# EAGLE schematic Maduino Zero 4G LTE A7670X v1.1 (EAGLE 6.1)
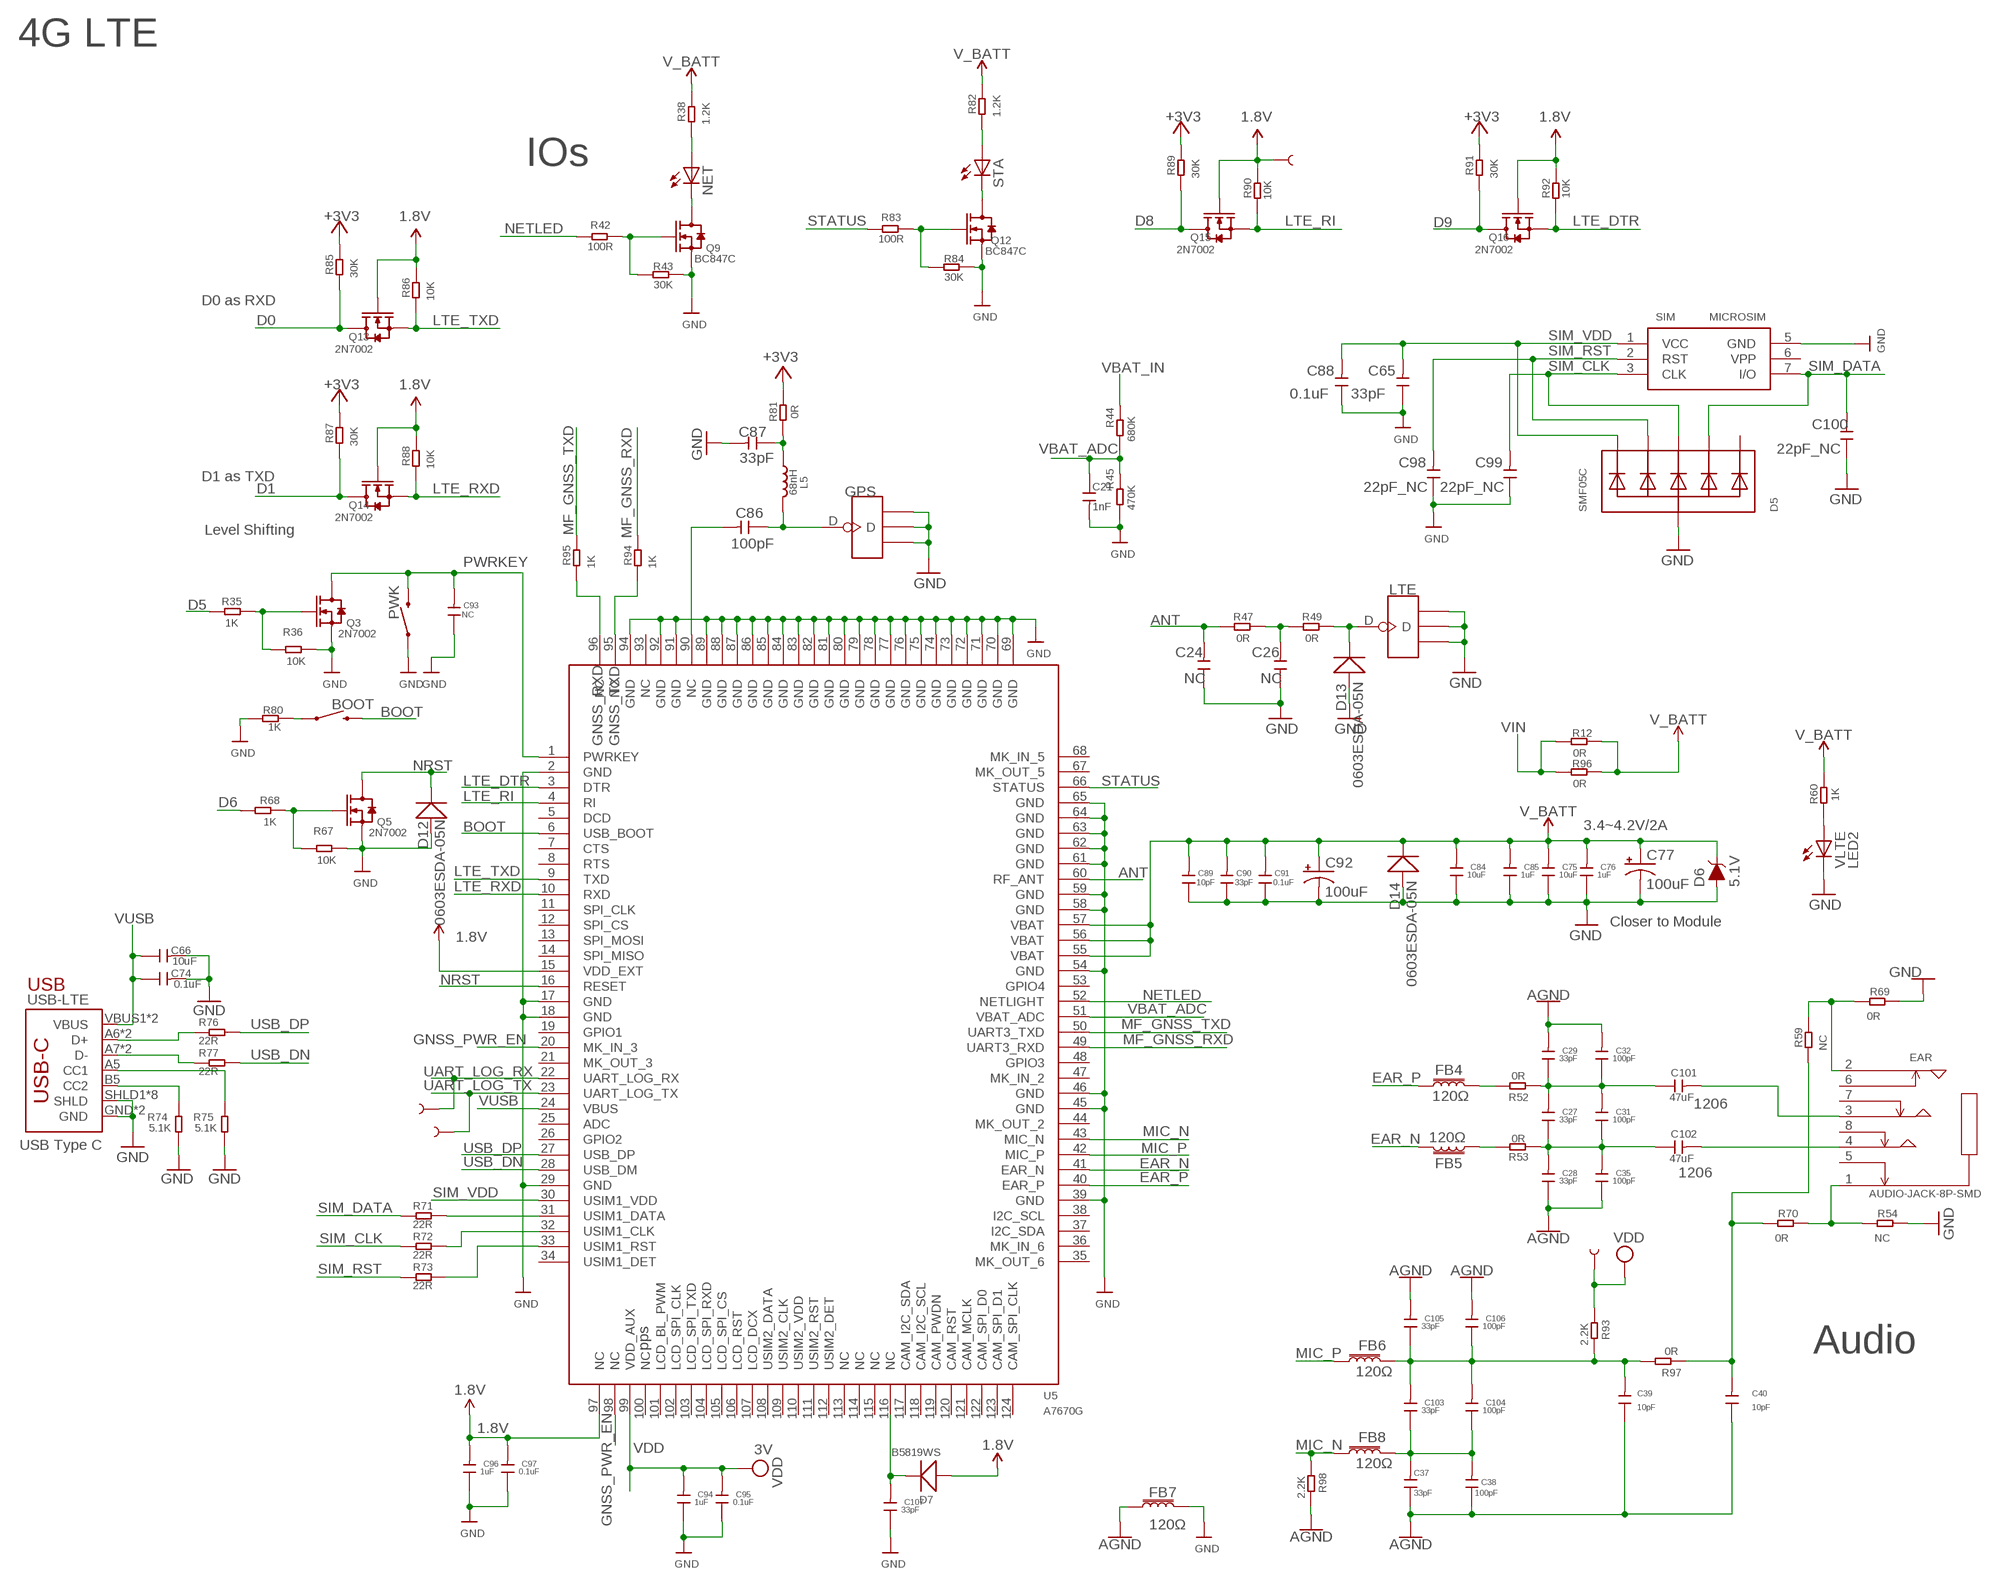
[diagram p0: schematic, sheet 1, part 1 of 2]
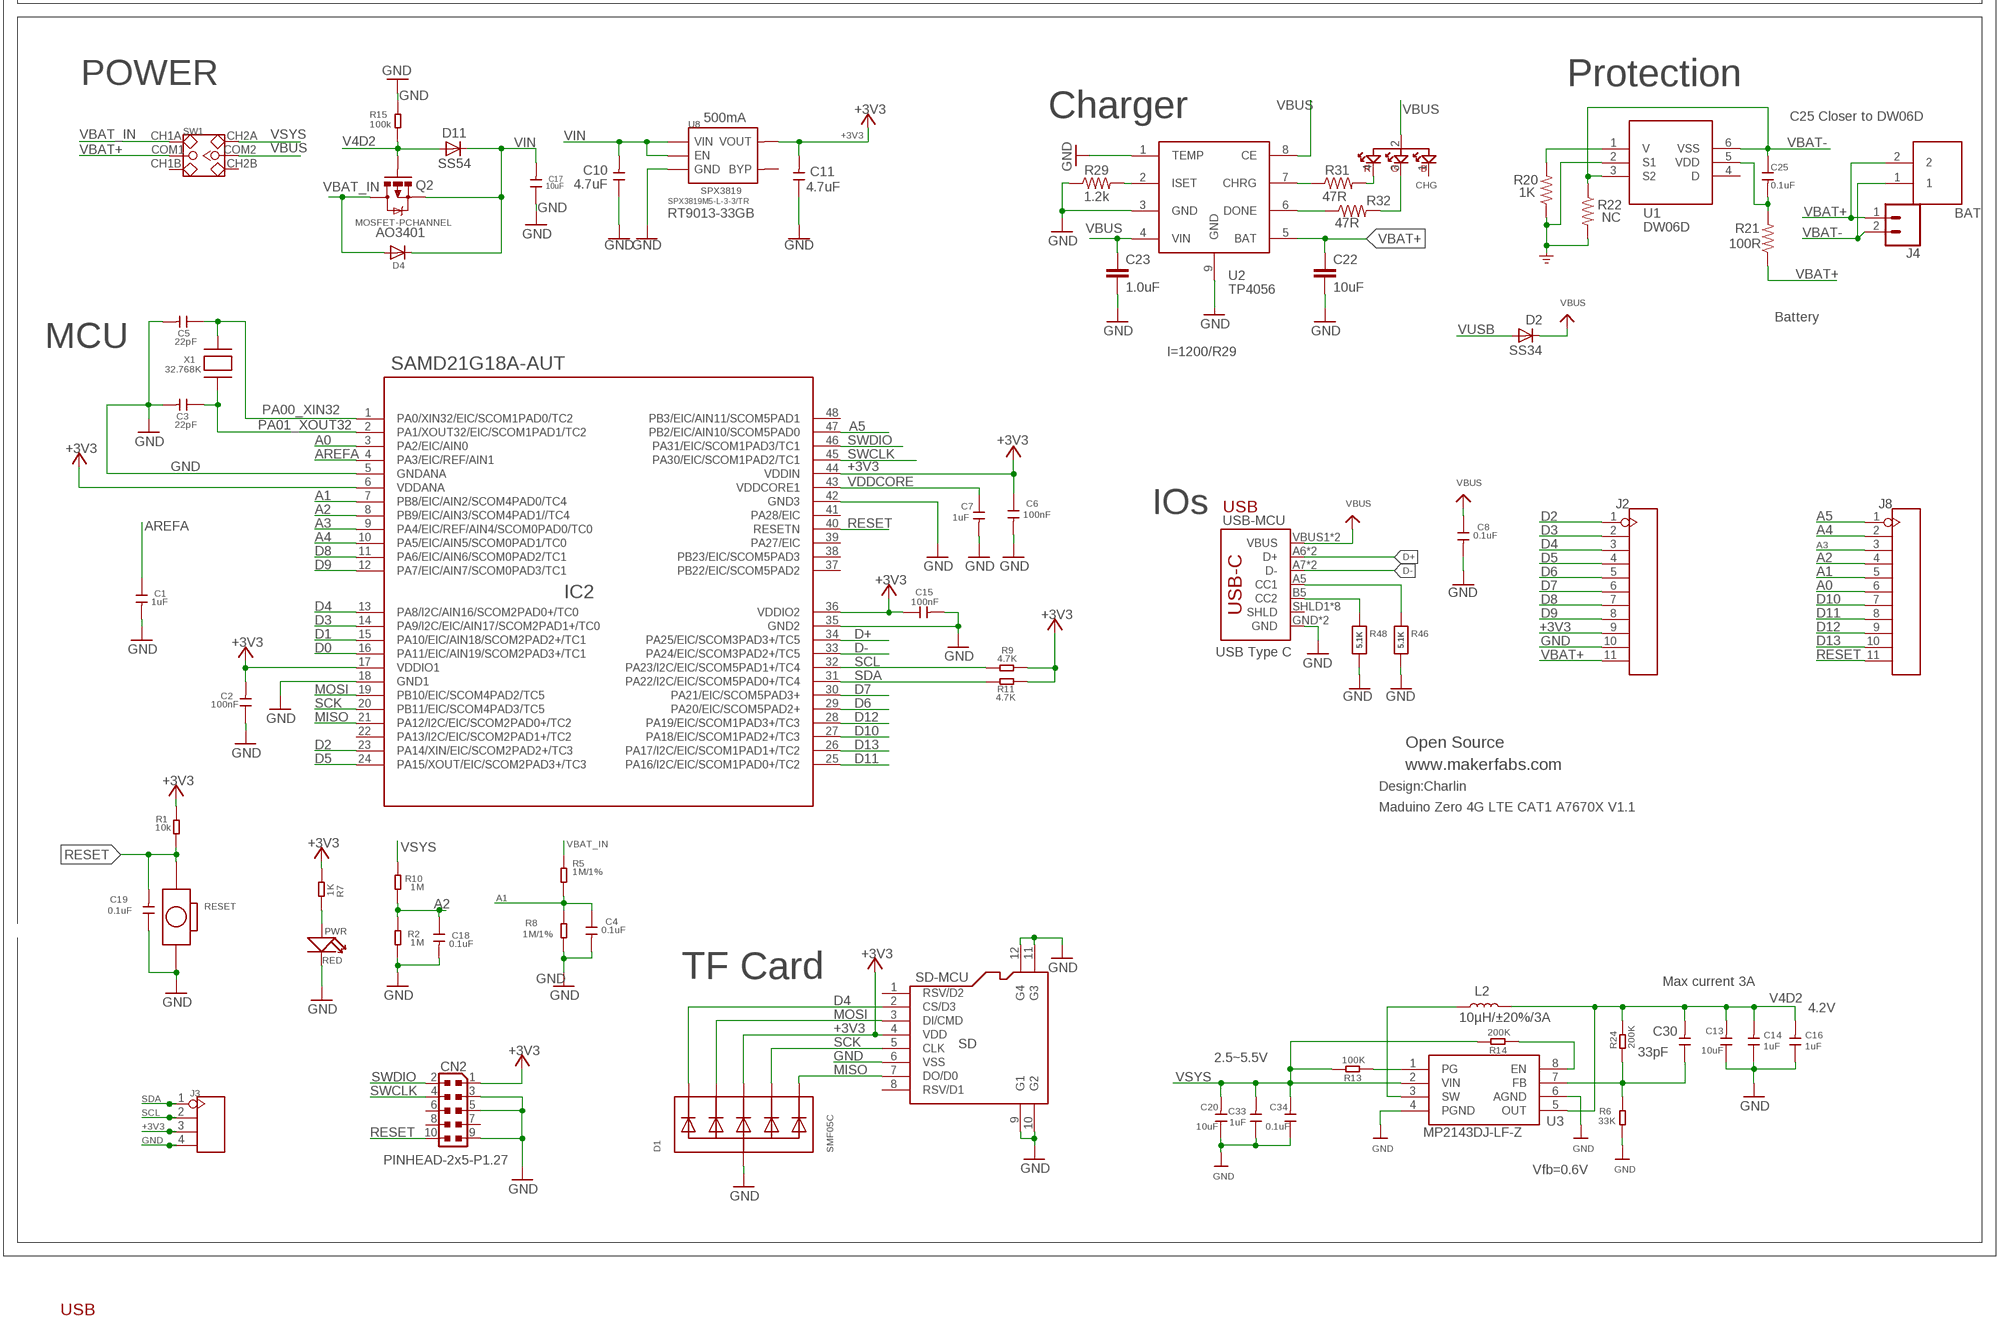
[diagram p1: schematic, sheet 1, part 2 of 2]

## Parts
BAT  PH2.0-2P-90-DIP  [PH2.0-2P-90-DIP]
BOOT  MOMENTARY-SWITCH-SPST-SMD-6.0X3.5MM  [TACTILE_SWITCH_SMD_6.0X3.5MM]
C1  1uF  C-0603  [0603]
C2  100nF  C-0603  [0603]
C3  22pF  C-0603  [0603]
C4  0.1uF  C-0603  [0603]
C5  22pF  C-0603  [0603]
C6  100nF  C-0603  [0603]
C7  1uF  C-0603  [0603]
C8  0.1uF  C-0603  [0603]
C10  4.7uF  C-0603  [0603]
C11  4.7uF  C-0603  [0603]
C13  10uF  C-0603  [0603]
C14  1uF  C-0603  [0603]
C15  100nF  C-0603  [0603]
C16  1uF  C-0603  [0603]
C17  10uF  C-0603  [0603]
C18  0.1uF  C-0603  [0603]
C19  0.1uF  C-0603  [0603]
C20  10uF  C-0603  [0603]
C21  1nF  C-0603  [0603]
C22  10uF  1.0UF-0603-16V-10%  [0603]
C23  1.0uF  1.0UF-0603-16V-10%  [0603]
C24  NC  C-0603  [0603]
C25  0.1uF  C-0603  [0603]
C26  NC  C-0603  [0603]
C27  33pF  C-0603  [0603]
C28  33pF  C-0603  [0603]
C29  33pF  C-0603  [0603]
C30  33pF  C-0603  [0603]
C31  100pF  C-0603  [0603]
C32  100pF  C-0603  [0603]
C33  1uF  C-0603  [0603]
C34  0.1uF  C-0603  [0603]
C35  100pF  C-0603  [0603]
C37  33pF  C-0603  [0603]
C38  100pF  C-0603  [0603]
C39  10pF  C-0603  [0603]
C40  10pF  C-0603  [0603]
C65  33pF  C-0603  [0603]
C66  10uF  C-0603  [0603]
C74  0.1uF  C-0603  [0603]
C75  10uF  C-0603  [0603]
C76  1uF  C-0603  [0603]
C77  100uF  68UF-POLAR-EIA3528-10V-10%(TANT)  [EIA3528]
C84  10uF  C-0603  [0603]
C85  1uF  C-0603  [0603]
C86  100pF  C-0603  [0603]
C87  33pF  C-0603  [0603]
C88  0.1uF  C-0603  [0603]
C89  10pF  C-0603  [0603]
C90  33pF  C-0603  [0603]
C91  0.1uF  C-0603  [0603]
C92  100uF  68UF-POLAR-EIA3528-10V-10%(TANT)  [EIA3528]
C93  NC  C-0603  [0603]
C94  1uF  C-0603  [0603]
C95  0.1uF  C-0603  [0603]
C96  1uF  C-0603  [0603]
C97  0.1uF  C-0603  [0603]
C98  22pF_NC  C-0603  [0603]
C99  22pF_NC  C-0603  [0603]
C100  22pF_NC  C-0603  [0603]
C101  47uF  DISCRETE_C-1206  [DISCRETE_C1206]
C102  47uF  DISCRETE_C-1206  [DISCRETE_C1206]
C103  33pF  C-0603  [0603]
C104  100pF  C-0603  [0603]
C105  33pF  C-0603  [0603]
C106  100pF  C-0603  [0603]
C107  33pF  C-0603  [0603]
CHG  E6C0606RGBC3UDA  [SMD4-160L160W]
CN2  PINHEAD-2x5-P1.27  0171_PH127-205DF055G00AROUND-PADS  [PINHEAD_2X05_127]
D1  SMF05C  TVSARRAY_5LANE  [SOT363]
D2  SS34  DIODE-DO-214AC  [DO-214AC]
D4  DIODESOD-323F  [SOD-323F]
D5  SMF05C  TVSARRAY_5LANE  [SOT363]
D6  5.1V  DIODE-ZENER-MMSZ5232BS  [SOD-323]
D7  B5819WS  D'0805'  [SOD323]
D11  SS54  DIODE-DO-214AC  [DO-214AC]
D12  0603ESDA-05N  DISCRETE_D0603  [DISCRETE_SOD523]
D13  0603ESDA-05N  DISCRETE_D0603  [DISCRETE_SOD523]
D14  0603ESDA-05N  DISCRETE_D0603  [DISCRETE_SOD523]
EAR  AUDIO-JACK-8P-SMD  AUDIO-JACK-8P-SMD'PJ-393'  [AUDIO8P-SMD-3.5-14.5X6.1X4.0MM]
FB4  120Ω  FERRITE_BEAD-0603  [0603]
FB5  120Ω  FERRITE_BEAD-0603  [0603]
FB6  120Ω  FERRITE_BEAD-0603  [0603]
FB7  120Ω  FERRITE_BEAD-0603  [0603]
FB8  120Ω  FERRITE_BEAD-0603  [0603]
GPS  ANTENNA-U-FL  [4P-U-FL]
IC2  SAMD21G18A-AUT  ATSAMD21G18A-AUT  [TQFP48-7X7]
J2  HEADER-11P-2.54  [11P-2.54]
J3  HEADER-4P-60/35MILROUND  [4P-65/35ROUND]
J4  CONN_02LOCK  [1X02_LOCK]
J8  HEADER-11P-2.54  [11P-2.54]
L2  10µH/±20%/3A  INDUCTOR-SRN6045-33UH  [SRN6045]
L5  68nH  L'0603'  [L0603]
LTE  ANTENNA-U-FL  [4P-U-FL]
NET  NET  LEDCHIP-LED0805  [CHIP-LED0805]
PWK  MOMENTARY-SWITCH-SPST-SMD-6.0X3.5MM  [TACTILE_SWITCH_SMD_6.0X3.5MM]
PWR  RED  LED'0603'  [LED-0603]
Q2  MOSFET-PCHANNEL  [SOT23-3]
Q3  2N7002  MOSFET-N'SOT23'  [SOT23]
Q5  2N7002  MOSFET-N'SOT23'  [SOT23]
Q9  BC847C  MOSFET-N'SOT23'  [SOT23]
Q12  BC847C  MOSFET-N'SOT23'  [SOT23]
Q13  2N7002  MOSFET-N'SOT23'  [SOT23]
Q14  2N7002  MOSFET-N'SOT23'  [SOT23]
Q15  2N7002  MOSFET-N'SOT23'  [SOT23]
Q16  2N7002  MOSFET-N'SOT23'  [SOT23]
R1  10k  R-0603  [R0603]
R2  1M  R-0603  [R0603]
R5  1M/1%  R-0603  [R0603]
R6  33K  R-0603  [R0603]
R7  1K  R-0603  [R0603]
R8  1M/1%  R-0603  [R0603]
R9  4.7K  R-0603  [R0603]
R10  1M  R-0603  [R0603]
R11  4.7K  R-0603  [R0603]
R12  0R  R-0603  [R0603]
R13  100K  R-0603  [R0603]
R14  200K  R-0603  [R0603]
R15  100k  R-0603  [R0603]
R20  1K  10KOHM-0603-1/10W-1%  [0603]
R21  100R  10KOHM-0603-1/10W-1%  [0603]
R22  NC  10KOHM-0603-1/10W-1%  [0603]
R24  200K  R-0603  [R0603]
R29  1.2k  2.49KOHM-0603-1/10W-1%  [0603]
R31  47R  330OHM-0603-1/10W-1%  [0603]
R32  47R  330OHM-0603-1/10W-1%  [0603]
R35  1K  R-0603  [R0603]
R36  10K  R-0603  [R0603]
R38  1.2K  R-0603  [R0603]
R42  100R  R-0603  [R0603]
R43  30K  R-0603  [R0603]
R44  680K  R-0603  [R0603]
R45  470K  R-0603  [R0603]
R46  5.1K  RESISTOR_0603_NOOUT  [0603-NO]
R47  0R  R-0603  [R0603]
R48  5.1K  RESISTOR_0603_NOOUT  [0603-NO]
R49  0R  R-0603  [R0603]
R52  0R  R-0603  [R0603]
R53  0R  R-0603  [R0603]
R54  NC  R-0603  [R0603]
R59  NC  R-0603  [R0603]
R60  1K  R-0603  [R0603]
R67  10K  R-0603  [R0603]
R68  1K  R-0603  [R0603]
R69  0R  R-0603  [R0603]
R70  0R  R-0603  [R0603]
R71  22R  R-0603  [R0603]
R72  22R  R-0603  [R0603]
R73  22R  R-0603  [R0603]
R74  5.1K  R-0603  [R0603]
R75  5.1K  R-0603  [R0603]
R76  22R  R-0603  [R0603]
R77  22R  R-0603  [R0603]
R80  1K  R-0603  [R0603]
R81  0R  R-0603  [R0603]
R82  1.2K  R-0603  [R0603]
R83  100R  R-0603  [R0603]
R84  30K  R-0603  [R0603]
R85  30K  R-0603  [R0603]
R86  10K  R-0603  [R0603]
R87  30K  R-0603  [R0603]
R88  10K  R-0603  [R0603]
R89  30K  R-0603  [R0603]
R90  10K  R-0603  [R0603]
R91  30K  R-0603  [R0603]
R92  10K  R-0603  [R0603]
R93  2.2K  R-0603  [R0603]
R94  1K  R-0603  [R0603]
R95  1K  R-0603  [R0603]
R96  0R  R-0603  [R0603]
R97  0R  R-0603  [R0603]
R98  2.2K  R-0603  [R0603]
RESET  BOTTON-2P-90D  [2P-7.62X3.56-90D]
SD-MCU  SD  HOLDER-MICROSD-8P  [8P-SMD]
SIM  MICROSIM  [MICROSIM]
STA  NET  LEDCHIP-LED0805  [CHIP-LED0805]
SW1  SWITCH-2CH-6P  [6P-2CH-2.54-7.6X3.0]
TP1  TEST-POINT3  [PAD.03X.03]
TP2  TEST-POINT3  [PAD.03X.03]
TP3  TEST-POINT3  [PAD.03X.03]
TP6  TEST-POINT3  [PAD.03X.03]
U1  DW06D  [SOT-23-6]
U2  TP4056  [SOP8-1.27P]
U3  MP2143DJ-LF-Z  [TSOT23-8]
U5  A7670G  [A7670G]
U8  SPX3819  [SOT23-5]
USB-LTE  USB_C5  [USB-C-16P-5]
USB-MCU  USB_C5  [USB-C-16P-5]
VLTE  LED2  LEDCHIP-LED0805  [CHIP-LED0805]
X1  32.768K  XTAL-3.2X1.5  [XTAL3215]

## Nets
1.8V: C96.2 C97.2 D7.+ Q13.1(G) Q14.1(G) Q15.1(G) Q16.1(G) R86.2 R88.2 R90.2 R92.2 TP6.P$1 U5.15(VDD_EXT) U5.97(NC)
+3V3: C2.2 C6.1 C11.2 C15.1 CN2.1 D1.4(C3) IC2.6(VDDANA) IC2.17(VDDIO1) IC2.36(VDDIO2) IC2.44(VDDIN) J2.9 J3.3 R1.2 R7.1 R9.2 R11.2 R81.2 R85.2 R87.2 R89.2 R91.2 SD-MCU.4(VDD) U8.5(VOUT)
A0: IC2.3(PA2/EIC/AIN0) J8.6
A1: C4.1 IC2.7(PB8/EIC/AIN2/SCOM4PAD0/TC4) J8.5 R5.1 R8.2
A2: C18.1 IC2.8(PB9/EIC/AIN3/SCOM4PAD1//TC4) J8.4 R2.2 R10.1
A3: IC2.9(PA4/EIC/REF/AIN4/SCOM0PAD0/TC0) J8.3
A4: IC2.10(PA5/EIC/AIN5/SCOM0PAD1/TC0) J8.2
A5: IC2.47(PB2/EIC/AIN10/SCOM5PAD0) J8.1
AGND: C28.1 C29.2 C32.2 C35.1 C37.1 C38.1 C39.1 C40.1 C105.2 C106.2 FB7.1 R98.2
ANT: C24.2 R47.1 U5.60(RF_ANT)
AREFA: C1.1 IC2.4(PA3/EIC/REF/AIN1)
BOOT: BOOT.2 U5.6(USB_BOOT)
D0: IC2.16(PA11/EIC/AIN19/SCOM2PAD3+/TC1) Q13.3(D) R85.1
D1: IC2.15(PA10/EIC/AIN18/SCOM2PAD2+/TC1) Q14.3(D) R87.1
D2: IC2.23(PA14/XIN/EIC/SCOM2PAD2+/TC3) J2.1
D3: IC2.14(PA9/I2C/EIC/AIN17/SCOM2PAD1+/TC0) J2.2
D4: D1.1(C1) IC2.13(PA8/I2C/AIN16/SCOM2PAD0+/TC0) J2.3 SD-MCU.2(CS/D3)
D5: IC2.24(PA15/XOUT/EIC/SCOM2PAD3+/TC3) J2.4 R35.2
D6: IC2.29(PA20/EIC/SCOM5PAD2+) J2.5 R68.2
D7: IC2.30(PA21/EIC/SCOM5PAD3+) J2.6
D8: IC2.11(PA6/EIC/AIN6/SCOM0PAD2/TC1) J2.7 Q15.3(D) R89.1
D9: IC2.12(PA7/EIC/AIN7/SCOM0PAD3/TC1) J2.8 Q16.3(D) R91.1
D10: IC2.27(PA18/EIC/SCOM1PAD2+/TC3) J8.7
D11: IC2.25(PA16/I2C/EIC/SCOM1PAD0+/TC2) J8.8
D12: IC2.28(PA19/EIC/SCOM1PAD3+/TC3) J8.9
D13: IC2.26(PA17/I2C/EIC/SCOM1PAD1+/TC2) J8.10
D+: IC2.34(PA25/EIC/SCOM3PAD3+/TC5) USB-MCU.A6(D+) USB-MCU.B6(D+)
D-: IC2.33(PA24/EIC/SCOM3PAD2+/TC5) USB-MCU.A7(D-) USB-MCU.B7(D-)
DONE: R32.1 U2.6(DONE)
EAR_N: FB5.2 U5.41(EAR_N)
EAR_P: FB4.1 U5.40(EAR_P)
GND: C1.2 C2.1 C3.2 C4.2 C5.2 C6.2 C7.2 C8.2 C10.1 C11.1 C13.1 C14.1 C15.2 C16.1 C17.1 C18.2 C19.1 C20.1 C21.2 C22.2 C23.2 C24.1 C26.1 C33.1 C34.1 C65.1 C66.2 C74.2 C75.1 C76.1 C77.C(-) C84.1 C85.1 C87.2 C88.1 C89.1 C90.1 C91.1 C92.C(-) C93.1 C94.1 C95.1 C96.1 C97.1 C98.1 C99.1 C100.1 C107.1 CN2.3 CN2.5 CN2.9 D1.2(A) D5.2(A) D6.A D12.+ D13.+ D14.+ FB7.2 GPS.GND1 GPS.GND2 GPS.GND3 IC2.5(GNDANA) IC2.18(GND1) IC2.35(GND2) IC2.42(GND3) J2.10 J3.4 LTE.GND1 LTE.GND2 LTE.GND3 PWK.1 PWR.- Q3.2(S) Q5.2(S) Q9.2(S) Q12.2(S) R2.1 R6.1 R8.1 R15.2 R20.1 R22.2 R29.1 R36.1 R43.1 R45.1 R46.2 R48.2 R54.2 R67.1 R69.2 R74.1 R75.1 R80.2 R84.1 RESET.P$2 SD-MCU.6(VSS) SD-MCU.9(G1) SD-MCU.10(G2) SD-MCU.11(G3) SD-MCU.12(G4) SIM.5(GND) U1.2(S1) U2.1(TEMP) U2.3(GND) U2.9(GND) U3.4(PGND) U3.6(AGND) U5.2(GND) U5.17(GND) U5.18(GND) U5.29(GND) U5.39(GND) U5.45(GND) U5.46(GND) U5.54(GND) U5.58(GND) U5.59(GND) U5.61(GND) U5.62(GND) U5.63(GND) U5.64(GND) U5.65(GND) U5.69(GND) U5.70(GND) U5.71(GND) U5.72(GND) U5.73(GND) U5.74(GND) U5.75(GND) U5.76(GND) U5.77(GND) U5.78(GND) U5.79(GND) U5.80(GND) U5.81(GND) U5.82(GND) U5.83(GND) U5.84(GND) U5.85(GND) U5.86(GND) U5.87(GND) U5.88(GND) U5.89(GND) U5.91(GND) U5.92(GND) U5.94(GND) U8.2(GND) USB-LTE.GND USB-LTE.GND2(GND) USB-LTE.SHLD1(SHLD) USB-LTE.SHLD2(SHLD) USB-LTE.SHLD3(SHLD) USB-LTE.SHLD4(SHLD) USB-LTE.SHLD5(SHLD) USB-LTE.SHLD6(SHLD) USB-LTE.SHLD7(SHLD) USB-LTE.SHLD8(SHLD) USB-MCU.GND USB-MCU.GND2(GND) VLTE.C
GNSS_PWR_EN: U5.20(MK_IN_3) U5.98(NC)
ISET: R29.2 U2.2(ISET)
LTE_DTR: Q16.2(S) R92.1 U5.3(DTR)
LTE_RI: Q15.2(S) R90.1 U5.4(RI)
LTE_RXD: Q14.2(S) R88.1 U5.10(RXD)
LTE_TXD: Q13.2(S) R86.1 U5.9(TXD)
MF_GNSS_RXD: R94.2 U5.49(UART3_RXD)
MF_GNSS_TXD: R95.2 U5.50(UART3_TXD)
MIC_N: FB8.1 R98.1 U5.43(MIC_N)
MIC_P: FB6.1 U5.42(MIC_P)
MISO: D1.6(C5) IC2.21(PA12/I2C/EIC/SCOM2PAD0+/TC2) SD-MCU.7(DO/D0)
MOSI: D1.3(C2) IC2.19(PB10/EIC/SCOM4PAD2/TC5) SD-MCU.3(DI/CMD)
N$3: PWR.+ R7.2
N$8: L2.1 U3.3(SW)
N$9: C25.2 R21.2 U1.5(VDD)
N$10: R20.2 U1.1(V)
N$11: CHG.3 R32.2
N$12: R31.1 U2.7(CHRG)
N$13: R13.1 U3.1(PG)
N$16: C30.1 R6.2 R24.1 U3.7(FB)
N$17: R14.1 U3.8(EN)
N$18: CHG.4 R31.2
N$22: Q9.1(G) R42.1 R43.2
N$23: NET.A R38.1
N$25: R46.1 USB-MCU.A5(CC1)
N$26: R48.1 USB-MCU.B5(CC2)
N$27: NET.C Q9.3(D)
N$28: C26.2 R47.2 R49.1
N$29: D13.- LTE.D R49.2
N$31: FB4.2 R52.2
N$32: C101.2 EAR.3
N$33: C27.1 C28.2 C31.1 C35.2 C102.1 R53.1
N$34: C40.2 R59.1 R70.1 R97.1
N$35: C39.2 C103.2 C104.2 C105.1 C106.1 FB6.2 R93.2 R97.2
N$36: EAR.2 R59.2 R69.1
N$37: EAR.1 R54.1 R70.2
N$38: FB5.1 R53.2
N$39: R71.1 U5.31(USIM1_DATA)
N$43: Q3.1(G) R35.1 R36.2
N$44: R72.1 U5.32(USIM1_CLK)
N$45: R73.1 U5.33(USIM1_RST)
N$46: R60.1 VLTE.A
N$47: R75.2 USB-LTE.A5(CC1)
N$53: R74.2 USB-LTE.B5(CC2)
N$55: R76.2 USB-LTE.A6(D+) USB-LTE.B6(D+)
N$56: R77.2 USB-LTE.A7(D-) USB-LTE.B7(D-)
N$61: BOOT.1 R80.1
N$62: C87.1 L5.1 R81.1
N$65: C86.1 GPS.D L5.2
N$66: C86.2 U5.90(NC)
N$67: Q12.1(G) R83.1 R84.2
N$68: R82.1 STA.A
N$70: Q5.1(G) R67.2 R68.1
N$71: Q12.3(D) STA.C
N$77: C27.2 C29.1 C31.2 C32.1 C101.1 R52.1
N$78: C102.2 EAR.4
N$79: R94.1 U5.95(NC)
N$80: R95.1 U5.96(NC)
N$81: C37.2 C38.2 C103.1 C104.1 FB8.2
N$82: C107.2 D7.- U5.116(NC)
NETLED: R42.2 U5.52(NETLIGHT)
NRST: D12.- Q5.3(D) U5.16(RESET)
PA00_XIN32: C5.1 IC2.1(PA0/XIN32/EIC/SCOM1PAD0/TC2) X1.P$2
PA01_XOUT32: C3.1 IC2.2(PA1/XOUT32/EIC/SCOM1PAD1/TC2) X1.P$1
PWRKEY: C93.2 PWK.2 Q3.3(D) U5.1(PWRKEY)
RESET: C19.2 CN2.10 IC2.40(RESETN) J8.11 R1.1 RESET.P$1
SCK: D1.5(C4) IC2.20(PB11/EIC/SCOM4PAD3/TC5) SD-MCU.5(CLK)
SCL: IC2.32(PA23/I2C/EIC/SCOM5PAD1+/TC4) J3.2 R9.1
SDA: IC2.31(PA22/I2C/EIC/SCOM5PAD0+/TC4) J3.1 R11.1
SIM_CLK: C99.2 D5.4(C3) R72.2 SIM.3(CLK)
SIM_DATA: C100.2 D5.3(C2) R71.2 SIM.7(I/O)
SIM_RST: C98.2 D5.5(C4) R73.2 SIM.2(RST)
SIM_VDD: C65.2 C88.2 D5.6(C5) SIM.1(VCC) U5.30(USIM1_VDD)
STATUS: R83.2 U5.66(STATUS)
SWCLK: CN2.4 IC2.45(PA30/EIC/SCOM1PAD2/TC1)
SWDIO: CN2.2 IC2.46(PA31/EIC/SCOM1PAD3/TC1)
UART_LOG_RX: TP3.P$1 U5.22(UART_LOG_RX)
UART_LOG_TX: TP2.P$1 U5.23(UART_LOG_TX)
USB_DN: R77.1 U5.28(USB_DM)
USB_DP: R76.1 U5.27(USB_DP)
V4D2: C13.2 C14.2 C16.2 C30.2 D11.A L2.2 Q2.1(G) R15.1 R24.2 U3.5(OUT)
V_BATT: C75.2 C76.2 C77.A(+) C84.2 C85.2 C89.2 C90.2 C91.2 C92.A(+) D6.C D14.- R12.1 R38.2 R60.2 R82.2 R96.1 U5.55(VBAT) U5.56(VBAT) U5.57(VBAT)
VBAT+: BAT.2 C22.1 J2.11 J4.1 R21.1 SW1.COM1 U2.5(BAT)
VBAT-: BAT.1 C25.1 J4.2 R22.1 U1.3(S2) U1.6(VSS)
VBAT_ADC: C21.1 R44.1 R45.2 U5.51(VBAT_ADC)
VBAT_IN: D4.A Q2.3(D) R5.2 R44.2 SW1.CH1A
VBUS: C8.1 C23.1 CHG.2 D2.C SW1.COM2 U2.4(VIN) U2.8(CE) USB-MCU.VBUS1(VBUS) USB-MCU.VBUS2(VBUS)
VDD: C94.2 C95.2 R93.1 TP1.P$1 U5.99(VDD_AUX)
VDDCORE: C7.1 IC2.43(VDDCORE1)
VIN: C10.2 C17.2 D4.C D11.C Q2.2(S) R12.2 R96.2 U8.1(VIN) U8.3(EN)
VSYS: C20.2 C33.2 C34.2 R10.2 R13.2 R14.2 SW1.CH2A U3.2(VIN)
VUSB: C66.1 C74.1 D2.A U5.24(VBUS) USB-LTE.VBUS1(VBUS) USB-LTE.VBUS2(VBUS)
Unconnected: CHG.1 CN2.6 CN2.7 CN2.8 D5.1(C1) EAR.5 EAR.6 EAR.7 EAR.8 IC2.22(PA13/I2C/EIC/SCOM2PAD1+/TC2) IC2.37(PB22/EIC/SCOM5PAD2) IC2.38(PB23/EIC/SCOM5PAD3) IC2.39(PA27/EIC) IC2.41(PA28/EIC) IC2.48(PB3/EIC/AIN11/SCOM5PAD1) SD-MCU.1(RSV/D2) SD-MCU.8(RSV/D1) SIM.6(VPP) SW1.CH1B SW1.CH2B U1.4(D) U5.5(DCD) U5.7(CTS) U5.8(RTS) U5.11(SPI_CLK) U5.12(SPI_CS) U5.13(SPI_MOSI) U5.14(SPI_MISO) U5.19(GPIO1) U5.21(MK_OUT_3) U5.25(ADC) U5.26(GPIO2) U5.34(USIM1_DET) U5.35(MK_OUT_6) U5.36(MK_IN_6) U5.37(I2C_SDA) U5.38(I2C_SCL) U5.44(MK_OUT_2) U5.47(MK_IN_2) U5.48(GPIO3) U5.53(GPIO4) U5.67(MK_OUT_5) U5.68(MK_IN_5) U5.93(NC) U5.100(NC) U5.101(LCD_BL_PWM) U5.102(LCD_SPI_CLK) U5.103(LCD_SPI_TXD) U5.104(LCD_SPI_RXD) U5.105(LCD_SPI_CS) U5.106(LCD_RST) U5.107(LCD_DCX) U5.108(USIM2_DATA) U5.109(USIM2_CLK) U5.110(USIM2_VDD) U5.111(USIM2_RST) U5.112(USIM2_DET) U5.113(NC) U5.114(NC) U5.115(NC) U5.117(CAM_I2C_SDA) U5.118(CAM_I2C_SCL) U5.119(CAM_PWDN) U5.120(CAM_RST) U5.121(CAM_MCLK) U5.122(CAM_SPI_D0) U5.123(CAM_SPI_D1) U5.124(CAM_SPI_CLK) U8.4(BYP) USB-MCU.SHLD1(SHLD) USB-MCU.SHLD2(SHLD) USB-MCU.SHLD3(SHLD) USB-MCU.SHLD4(SHLD) USB-MCU.SHLD5(SHLD) USB-MCU.SHLD6(SHLD) USB-MCU.SHLD7(SHLD) USB-MCU.SHLD8(SHLD)

## Notes on the sheet
- 4G LTE
- IOs
- D0 as RXD
- D1 as TXD
- Level Shifting
- GNSS_RXD | GNSS_TXD
- 3.4~4.2V/2A
- Closer to Module
- USB
- 1206
- USB Type C
- 1206
- pps | Audio
- 3V
- POWER | Protection
- Charger | C25 Closer to DW06D
- 500mA
- SPX3819M5-L-3-3/TR
- RT9013-33GB | BAT
- AO3401
- Battery
- MCU
- I=1200/R29
- IOs | USB
- USB Type C
- Open Source
- www.makerfabs.com
- Design:Charlin
- Maduino Zero 4G LTE CAT1 A7670X V1.1
- TF Card
- Max current 3A
- 4.2V
- 2.5~5.5V
- Vfb=0.6V
- USB

## Library data of the parts
BAT = Connector:PH2.0-2P-90-DIP
BOOT PWK = SparkFun-Switches:MOMENTARY-SWITCH-SPST: Momentary Switch (Pushbutton) - SPST Normally-open (NO) SPST momentary switches (buttons, pushbuttons). Variants PTH-12MM - 12mm square, through-hole Momentary Pushbutton Switch - 12mm Square <https://www.sparkfun.com/products/9190> (COM-09190) PTH-6.0MM, PTH-6.0MM-KIT - 6.0mm square, through-hole Mini Pushbutton Switch <https://www.sparkfun.com/products/97> (COM-00097) KIT package intended for soldering kit's - only one side of pads' copper is exposed. PTH-RIGHT-ANGLE-KIT - Right-angle, through-hole Right Angle Tactile Button <https://www.sparkfun.com/products/10791> - Used on SparkFun BigTime Watch Kit <https://www.sparkfun.com/products/11734> SMD-12MM - 12mm square, surface-mount Tactile Button - SMD (12mm) <https://www.sparkfun.com/products/12993> (COM-12993) Used on SparkFun PicoBoard <https://www.sparkfun.com/products/11888> SMD-4.5MM - 4.5mm Square Trackball Switch Used on SparkFun Blackberry Trackballer Breakout <https://www.sparkfun.com/products/13169> SMD-4.6MMX2.8MM - 4.60mm x 2.80mm, surface mount Used on SparkFun SAMD21 Mini Breakout <https://www.sparkfun.com/products/13664> SMD-5.2MM, SMD-5.2-REDUNDANT - 5.2mm square, surface-mount Mini Pushbutton Switch - SMD <https://www.sparkfun.com/products/8720> (COM-08720) Used on Arduino Pro Mini <https://www.sparkfun.com/products/11114> REDUNDANT package connects both switch circuits together SMD-6.0X3.5MM - 6.0 x 3.5mm, surface mount Momentary Reset Switch SMD <https://www.sparkfun.com/products/8229> (COM-08229) SMD-6.2MM-TALL - 6.2mm square, surface mount Tactile Button - SMD (6mm) <https://www.sparkfun.com/products/12992> Used on SparkFun Digital Sandbox <https://www.sparkfun.com/products/12651> SMD-RIGHT-ANGLE - Right-angle, surface mount Used on SparkFun Block for Intel® Edison - Arduino <https://www.sparkfun.com/products/13036>; PROD_ID: SWCH-00815; SF_SKU: COM-08229
C1-C8 C10 C11 C13-C21 C24-C35 C37-C40 C65 C66 C74-C76 C84-C91 C93-C100 C103-C107 = Discrete:C*: Ceramic Capacitors
C22 = SparkFun-Capacitors:1.0UF: 1µF ceramic capacitors A capacitor is a passive two-terminal electrical component used to store electrical energy temporarily in an electric field.; PROD_ID: CAP-00868; VALUE: 1.0uF
C23 = SparkFun-Capacitors:1.0UF: 1µF ceramic capacitors A capacitor is a passive two-terminal electrical component used to store electrical energy temporarily in an electric field.; PROD_ID: CAP-00868
C77 C92 = SparkFun-Capacitors:68UF-POLAR: 68µF polarized capacitors A capacitor is a passive two-terminal electrical component used to store electrical energy temporarily in an electric field.; PROD_ID: CAP-10790; VALUE: 68uF
C101 C102 = A9G:DISCRETE_C*: Ceramic Capacitors
CHG = self:E6C0606RGBC3UDA
CN2 = Connettori:0171_PH127-205DF055G00A: 2x5 PASSO 1,27
D1 D5 = microbuilder:TVSARRAY_5LANE: Voltage Transient Suppressor Array SOT363 SMF05C - 100W 5V: Digikey - SMF05CT1GOSCT-ND
D2 D11 = diode:DIODE-: DIODE
D4 = adafruit2:DIODE: Diode SMADIODE - SMA Surface Mount Package 20V 1A Schottky Diode Digikey: 641-1014-6-ND DO-1N4148 - Through Hole Small Current Diode SOD-123 20V 1 A (.5mV Vf) Schottky Diode - Digikey: MBRX120TPMSCT-ND SOD-323 10V 570mA (.38mV Vf, 3ns) Schottky Diode - Digikey: ZLLS410CT-ND SOD-523 30V 30mA Schottky Diode (RB751S-40TE61) - Digikey: RB751S-40TE61CT-ND SOT23-R/W - SOT23 Package (R = Solder Paste/Reflow Ovens, W = Hand-Soldering) BAT54Film 40V 300mA - Digikey: 497-7162-1-ND
D6 = SparkFun-DiscreteSemi:DIODE-ZENER: Zener Diode A Zener diode allows current to flow from its anode to its cathode like a normal semiconductor diode, but it also permits current to flow in the reverse direction when its "Zener voltage" is reached. - WIkipedia; PROD_ID: DIO-12442; VALUE: 5.6V
D7 = Discrete:D*
D12-D14 = L:DISCRETE_D*
EAR = Connector-new:AUDIO-JACK-8P-SMD: 320040009
FB4-FB8 = SparkFun-Coils:FERRITE_BEAD: Ferrite Bead (blocks, cores, rings, chokes, etc.) Inductor with layers of ferrite used to suppress high frequencies. Often used to isolate high frequency noise. SparkFun Products: IOIO-OTG - V2.2 <https://www.sparkfun.com/products/13613> SparkFun SAMD21 Mini Breakout <https://www.sparkfun.com/products/13664> SparkFun 6 Degrees of Freedom Breakout - LSM6DS3 <https://www.sparkfun.com/products/13339> SparkFun SAMD21 Dev Breakout <https://www.sparkfun.com/products/13672>; PROD_ID: NDUC-13805; VALUE: 30Ω/1.8A
GPS LTE = Connector:ANTENNA-U-FL
IC2 = IC:ATSAMD21G18A-AUT: Atmel D21 32bit ARM Cortex-M0 microcontroller - 48 PIN TQFP 256KB flash memory + 32KB SRAM
J2 J8 = Connector:HEADER-11P
J3 = Connector:HEADER-4P
J4 = SparkFun-Connectors:CONN_02: Multi connection point. Often used as Generic Header-pin footprint for 0.1 inch spaced/style header connections On any of the 0.1 inch spaced packages, you can populate with these: Break Away Headers - Straight <https://www.sparkfun.com/products/116> (PRT-00116) Break Away Male Headers - Right Angle <https://www.sparkfun.com/products/553> (PRT-00553) Female Headers <https://www.sparkfun.com/products/115> (PRT-00115) Break Away Headers - Machine Pin <https://www.sparkfun.com/products/117> (PRT-00117) Break Away Female Headers - Swiss Machine Pin <https://www.sparkfun.com/products/743> (PRT-00743) For SCREWTERMINALS and SPRING TERMINALS visit here: Screw Terimnals on SparkFun.com <https://www.sparkfun.com/search/results?term=Screw+Terminals> (5mm/3.5mm/2.54mm spacing) This device is also useful as a general connection point to wire up your design to another part of your project. Our various solder wires solder well into these plated through hole pads. Hook-Up Wire - Assortment (Stranded, 22 AWG) <https://www.sparkfun.com/products/11375> (PRT-11375) Hook-Up Wire - Assortment (Solid Core, 22 AWG) <https://www.sparkfun.com/products/11367> (PRT-11367) View the entire wire category on our website here <https://www.sparkfun.com/categories/141> Special notes: Molex polarized connector foot print use with: PRT-08233 with associated crimp pins and housings. 2.54_SCREWTERM for use with PRT-10571. 3.5mm Screw Terminal footprints for PRT-08084 5mm Screw Terminal footprints for use with PRT-08432
L2 = SparkFun-Coils:INDUCTOR: Inductors Resist changes in electrical current. Basically a coil of wire. SparkFun Products: SparkFun Load Cell Amplifier - HX711 <https://www.sparkfun.com/products/13879> IOIO-OTG - V2.2 <https://www.sparkfun.com/products/13613>; PROD_ID: NDUC-11627; VALUE: 33µH/±20%/1.4A
L5 = Discrete:L*
NET STA VLTE = adafruit2:LED: LED OSRAM: - CHIPLED LG R971, LG N971, LY N971, LG Q971, LY Q971, LO R971, LY R971 LH N974, LH R974 LS Q976, LO Q976, LY Q976 LO Q996 - Hyper CHIPLED LW Q18S LB Q993, LB Q99A, LB R99A - SideLED LS A670, LO A670, LY A670, LG A670, LP A670 LB A673, LV A673, LT A673, LW A673 LH A674 LY A675 LS A676, LA A676, LO A676, LY A676, LW A676 LS A679, LY A679, LG A679 - Hyper Micro SIDELED® LS Y876, LA Y876, LO Y876, LY Y876 LT Y87S - SmartLED LW L88C, LW L88S LB L89C, LB L89S, LG L890 LS L89K, LO L89K, LY L89K LS L896, LA L896, LO L896, LY L896 - TOPLED LS T670, LO T670, LY T670, LG T670, LP T670 LSG T670, LSP T670, LSY T670, LOP T670, LYG T670 LG T671, LOG T671, LSG T671 LB T673, LV T673, LT T673, LW T673 LH T674 LS T676, LA T676, LO T676, LY T676, LB T676, LH T676, LSB T676, LW T676 LB T67C, LV T67C, LT T67C, LS T67K, LO T67K, LY T67K, LW E67C LS E67B, LA E67B, LO E67B, LY E67B, LB E67C, LV E67C, LT E67C LW T67C LS T679, LY T679, LG T679 LS T770, LO T770, LY T770, LG T770, LP T770 LB T773, LV T773, LT T773, LW T773 LH T774 LS E675, LA E675, LY E675, LS T675 LS T776, LA T776, LO T776, LY T776, LB T776 LHGB T686 LT T68C, LB T68C - Hyper Mini TOPLED® LB M676 - Mini TOPLED Santana® LG M470 LS M47K, LO M47K, LY M47K Source: http://www.osram.convergy.de/
PWR = Discrete:LED*
Q2 = User-Submitted:MOSFET-PCHANNEL: Generic PMOSFET IRLML2244 - TRANS-11153 (SOT-23 -20V -4.3A) (1.Gate 2.Source 3.Drain) FQP27P06 - COM-10349 <http://www.sparkfun.com/products/10349> (TO-220 -60V -27A) (1.Gate 2.Source 3.Drain); PROD_ID: TRANS-08285
Q3 Q5 Q9 Q12-Q16 = Discrete:MOSFET-N: IRLL014: http://www.vishay.com/docs/91319/sihll014.pdf
R1 R2 R5-R15 R24 R35 R36 R38 R42-R45 R47 R49 R52-R54 R59 R60 R67-R77 R80-R98 = Discrete:R*
R20-R22 = SparkFun-Resistors:10KOHM: 10kΩ resistor A resistor is a passive two-terminal electrical component that implements electrical resistance as a circuit element. Resistors act to reduce current flow, and, at the same time, act to lower voltage levels within circuits.; PROD_ID: RES-00824; VALUE: 10k
R29 = SparkFun-Resistors:2.49KOHM: 2.49kΩ resistor A resistor is a passive two-terminal electrical component that implements electrical resistance as a circuit element. Resistors act to reduce current flow, and, at the same time, act to lower voltage levels within circuits. - Wikipedia; PROD_ID: RES-09568; VALUE: 2.49k
R31 R32 = SparkFun-Resistors:330OHM: 330Ω resistor A resistor is a passive two-terminal electrical component that implements electrical resistance as a circuit element. Resistors act to reduce current flow, and, at the same time, act to lower voltage levels within circuits. - Wikipedia; PROD_ID: RES-00818; VALUE: 330
R46 R48 = microbuilder:RESISTOR: Resistors For new designs, use the packages preceded by an '_' character since they are more reliable: The following footprints should be used on most boards: _0402 - Standard footprint for regular board layouts _0603 - Standard footprint for regular board layouts _0805 - Standard footprint for regular board layouts _1206 - Standard footprint for regular board layouts For extremely tight-pitch boards where space is at a premium, the following 'micro-pitch' footprints can be used (smaller pads, no silkscreen outline, etc.): _0402MP - Micro-pitch footprint for very dense/compact boards _0603MP - Micro-pitch footprint for very dense/compact boards _0805MP - Micro-pitch footprint for very dense/compact boards _1206MP - Micro-pitch footprint for very dense/compact boards
RESET = Discrete:BOTTON-2P
SD-MCU = Connector:HOLDER-MICROSD-8P
SIM = Connector:MICROSIM
SW1 = Discrete:SWITCH-2CH-6P
TP1-TP3 TP6 = SparkFun-Connectors:TEST-POINT: SparkFun Test Points Bare copper test points for troubleshooting or In-Circuit-Testing. These are used by our Production team for verifying production board runs using pogo-pins on test beds. SparkFun Products: SparkFun LSM9DS1 Breakout <https://www.sparkfun.com/products/13284> SparkFun PSOC <https://www.sparkfun.com/products/13714> SparkFun Load Cell Amplifier <https://www.sparkfun.com/products/13879>
U1 = self:DW06D
U2 = self:TP4056
U3 = sale:MP2143DJ-LF-Z
U5 = sale:A7670G
U8 = IC:SPX3819
USB-LTE USB-MCU = USBC:USB_C: USB Type C 16Pin Connector Super Speed pins not available on the 16-pin purely SMD connector so this part is best for USB 2.0 implementations. D1 and D2 are tied together enabling D+/- no matter which way the cable is plugged into the connector. The two channel configuration pins (CC1/2) are exposed. These are normally connected to ground via 5.1k resistors but can be reconfigured for high current/high power applications.
X1 = adafruit2:XTAL: Low cost SMT crystals, no capacitors included http://www.ladyada.net/library/eagle

## Net classes
0 default: width 0.203 mm
2 gnd: width 0.305 mm, drill 0.559 mm, clearance 0.254 mm
3 usbvcc: width 0.508 mm, drill 0.61 mm, clearance 0.254 mm
4 USBpair: width 0.254 mm, drill 0.406 mm, clearance 0.406 mm